# EAGLE design thermometer_temp_sense (EAGLE 6.0)
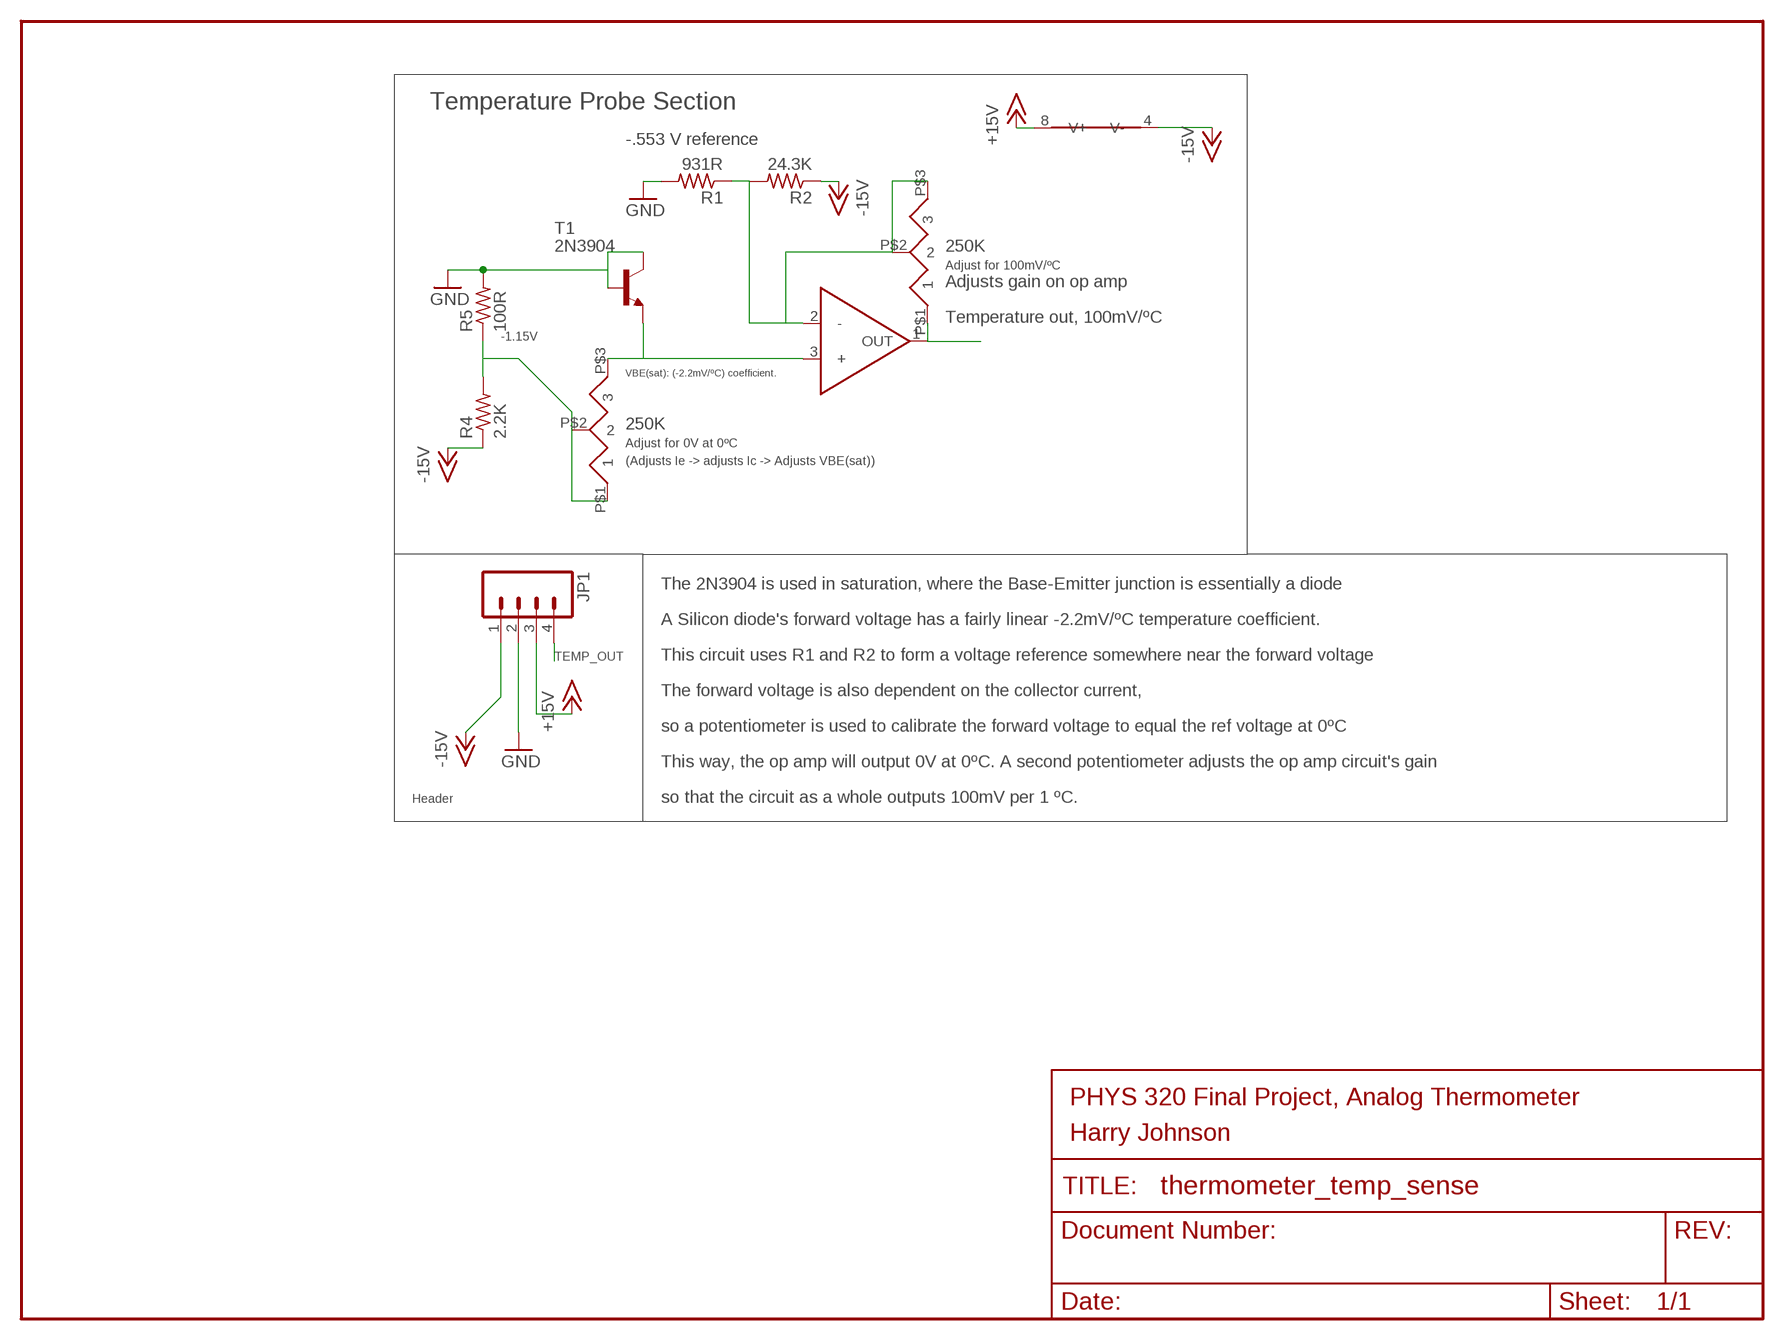
[diagram p0: schematic, sheet 1]

## Parts
JP1  M04PTH  [1X04]
R1  931R  R-US_0207/10  [0207/10]
R2  24.3K  R-US_0207/10  [0207/10]
R4  2.2K  R-US_0207/10  [0207/10]
R5  100R  R-US_0207/10  [0207/10]
T1  2N3904  2N2222  [TO92-EBC-OVAL]
U$1  TS522IN  [DIL08]
U$2  250K  POT  [PV36Y254C01B00]
U$3  250K  POT  [PV36Y254C01B00]

## Nets
+15V: JP1.3 U$1.8(V+)
-15V: JP1.1 R2.1 R4.1 U$1.4(V-)
GND: JP1.2 R1.2 R5.2 T1.B T1.C
N$2: R1.1 R2.2 U$1.2(-) U$3.P$2 U$3.P$3
N$3: R4.2 R5.1 U$2.P$1 U$2.P$2
N$4: T1.E U$1.3(+) U$2.P$3
TEMP_OUT: JP1.4 U$1.1(OUT) U$3.P$1
Unconnected: U$1.5(+) U$1.6(-) U$1.7(OUT)

## Notes on the sheet
- Temperature Probe Section
- -.553 V reference
- 250K
- Adjust for 100mV/ºC
- Adjusts gain on op amp
- Temperature out, 100mV/ºC
- -1.15V
- VBE(sat): (-2.2mV/ºC) coefficient.
- 250K
- Adjust for 0V at 0ºC
- (Adjusts Ie -> adjusts Ic -> Adjusts VBE(sat))
- The 2N3904 is used in saturation, where the Base-Emitter junction is essentially a diode
- A Silicon diode's forward voltage has a fairly linear -2.2mV/ºC temperature coefficient.
- This circuit uses R1 and R2 to form a voltage reference somewhere near the forward voltage
- The forward voltage is also dependent on the collector current,
- so a potentiometer is used to calibrate the forward voltage to equal the ref voltage at 0ºC
- This way, the op amp will output 0V at 0ºC. A second potentiometer adjusts the op amp circuit's gain
- Header | so that the circuit as a whole outputs 100mV per 1 ºC.
- PHYS 320 Final Project, Analog Thermometer
- Harry Johnson

## Library data of the parts
JP1 = SparkFun:M04: Header 4 Standard 4-pin 0.1" header. Use with straight break away headers (SKU : PRT-00116), right angle break away headers (PRT-00553), swiss pins (PRT-00743), machine pins (PRT-00117), and female headers (PRT-00115). Molex polarized connector foot print use with SKU : PRT-08231 with associated crimp pins and housings.
R1 R2 R4 R5 = adafruit:R-US_: RESISTOR, American symbol
T1 = adafruit:2N2222: NPN TRANSISTOR Big oval pads
U$1 = customswitch:TS522IN
U$2 U$3 = customswitch:POT

## Board
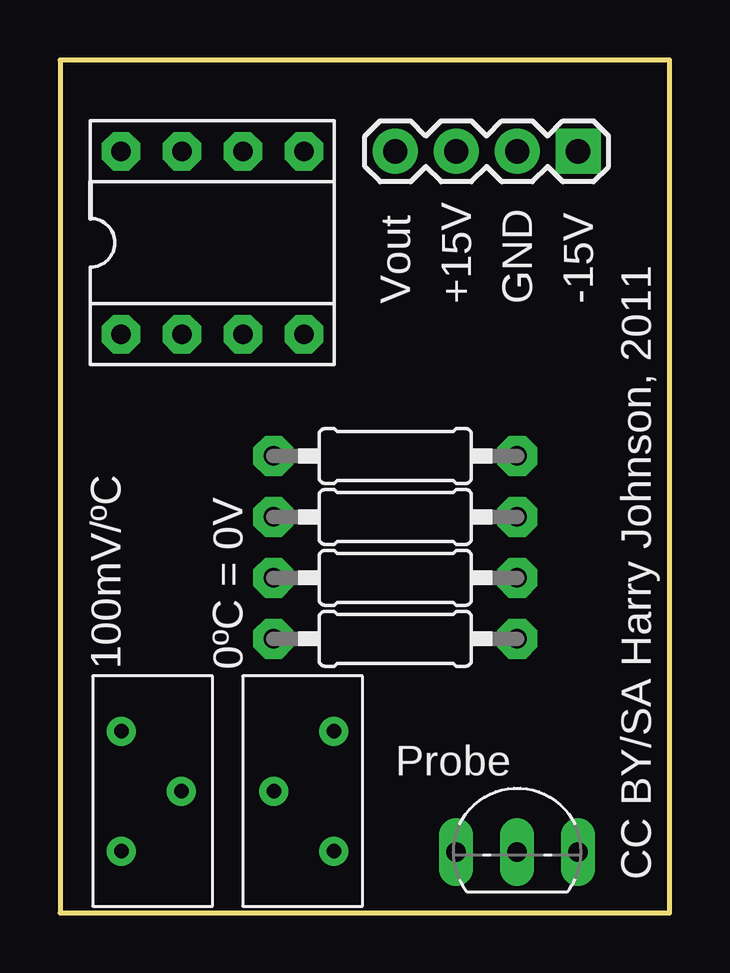
[diagram p1: board, top side]
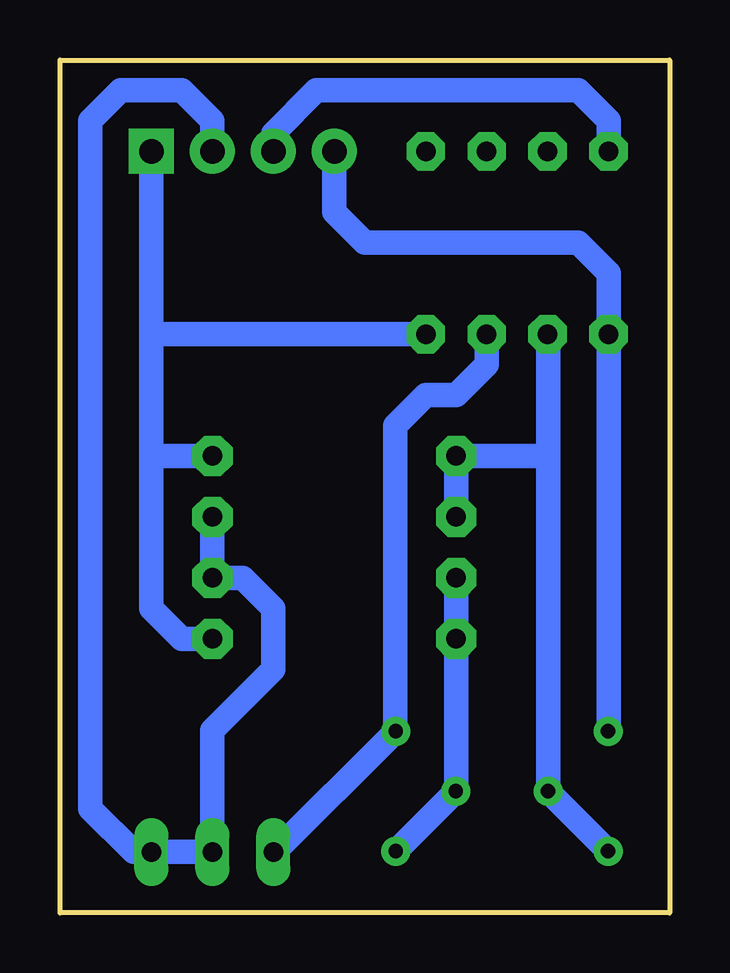
[diagram p2: board, bottom side, seen from below]

Size 25.4 x 35.56 mm. Coordinates in mm from the lower left corner, seen from the top.
Outline: 0,0 25.4,0 25.4,35.56 0,35.56 0,0
Copper layers (1*16): Top 0.035mm / dielectric 1.5mm / Bottom 0.035mm
Design rules: minimum track width 8mil, minimum drill 20mil, track to track 10mil, track to pad 10mil, pad to pad 10mil, via to via 10mil, smd to smd 8mil, copper to edge 10mil, drill to drill 8mil, minimum pad ring 12mil, minimum via ring 10mil, stop-mask expansion 4mil, vias tented up to drill 25mil, thermal gap 10mil

### Footprints (pad centres in the part's own frame; a part is rotated, then mirrored left to right if it is on the bottom)
1X04 = drill 1.016 pad 1.88 square: 1 0,0 | drill 1.016 pad 1.88: 2 2.54,0; 3 5.08,0; 4 7.62,0
0207/10 = drill 0.813 pad 1.676 octagon: 1 -5.08,0; 2 5.08,0
TO92-EBC-OVAL = drill 0.813 long: B 0,-1.27; C 2.54,-1.27; E -2.54,-1.27
DIL08 = drill 0.813 pad 1.6 octagon: 1 -3.81,-3.81; 2 -1.27,-3.81; 3 1.27,-3.81; 4 3.81,-3.81; 5 3.81,3.81; 6 1.27,3.81; 7 -1.27,3.81; 8 -3.81,3.81
PV36Y254C01B00 = drill 0.6: P$1 2.5,1.25; P$2 0,-1.25; P$3 -2.5,1.25

### Placement (x,y rotation side)
JP1  21.59,31.75 180 top
R1  13.97,16.51 0 top
R2  13.97,19.05 180 top
R4  13.97,11.43 180 top
R5  13.97,13.97 0 top
T1  19.05,3.81 0 top
U$1  6.35,27.94 0 top
U$2  10.16,5.08 270 top
U$3  3.81,5.08 90 top

### Tracks (layer width: path | path; a pad name or v marks a point on that pad's centre or on a via)
+15V
  Bottom 1.016: U$1.8 2.54,33.02 3.81,34.29 14.71,34.29 16.51,32.49 JP1.3
-15V
  Bottom 1.016: 21.59,19.05 21.59,24.13 | 21.59,24.13 JP1.1 | 21.59,19.05 R2.1 | 21.59,24.13 U$1.4 | R4.1 20.32,11.43 21.59,12.7 21.59,19.05
GND
  Bottom 1.016: R1.2 R5.2 17.78,13.97 16.51,12.7 16.51,10.16 19.05,7.62 T1.B T1.C 22.33,2.54 24.13,4.34 24.13,33.02 22.86,34.29 20.32,34.29 19.05,33.02 JP1.2
N$2
  Bottom 0.813: 5.06,24.11 U$1.2
  Bottom 1.016: U$3.P$3 U$3.P$2 5.06,19.05 | 5.06,19.05 5.06,24.11 | R1.1 R2.2 5.06,19.05
N$3
  Bottom 0.813: U$2.P$2 8.89,5.08
  Bottom 1.016: R5.1 R4.2 8.89,5.08 | U$2.P$1 U$2.P$2
N$4
  Bottom 0.406: U$2.P$3 11.43,7.6
  Bottom 0.61: 16.51,2.48 T1.E
  Bottom 1.016: U$2.P$3 16.51,2.48 | 11.43,7.6 11.43,20.32 10.16,21.59 8.89,21.59 7.62,22.86 U$1.3
TEMP_OUT
  Bottom 1.016: U$3.P$1 2.54,7.58 U$1.1 2.54,26.67 3.81,27.94 12.7,27.94 13.97,29.21 JP1.4

### Text on the board
tPlace: Vout | +15V | GND | -15V | 100mV/ºC | 0ºC = 0V | Probe | CC BY/SA Harry Johnson, 2011